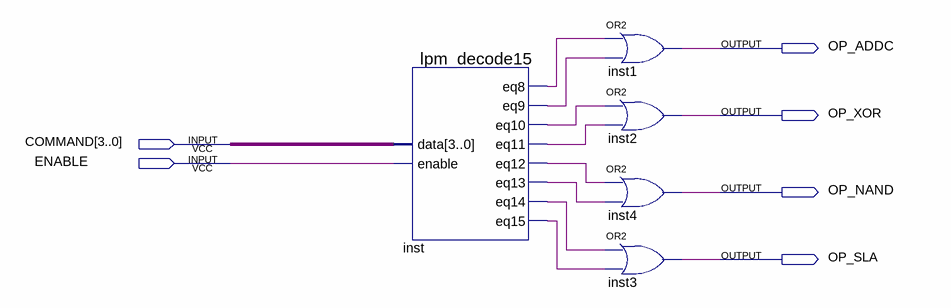
[diagram p0: schematic sheet]
// Quartus schematic PARCER.bdf as structural Verilog: 5 symbols, 6 pins
module PARCER (
  input  [3:0] COMMAND,
  input  ENABLE,
  output OP_ADDC,
  output OP_XOR,
  output OP_NAND,
  output OP_SLA
);

  wire inst_eq8, inst_eq9, inst_eq10, inst_eq11, inst_eq12, inst_eq13, inst_eq14, inst_eq15;

  lpm_decode15 inst (
    .data(COMMAND), .enable(ENABLE), .eq8(inst_eq8), .eq9(inst_eq9), .eq10(inst_eq10), .eq11(inst_eq11),
    .eq12(inst_eq12), .eq13(inst_eq13), .eq14(inst_eq14), .eq15(inst_eq15));
  or inst1 (OP_ADDC, inst_eq8, inst_eq9);
  or inst2 (OP_XOR, inst_eq10, inst_eq11);
  or inst4 (OP_NAND, inst_eq12, inst_eq13);
  or inst3 (OP_SLA, inst_eq14, inst_eq15);
endmodule
